# EAGLE design board (EAGLE 9.1.3)
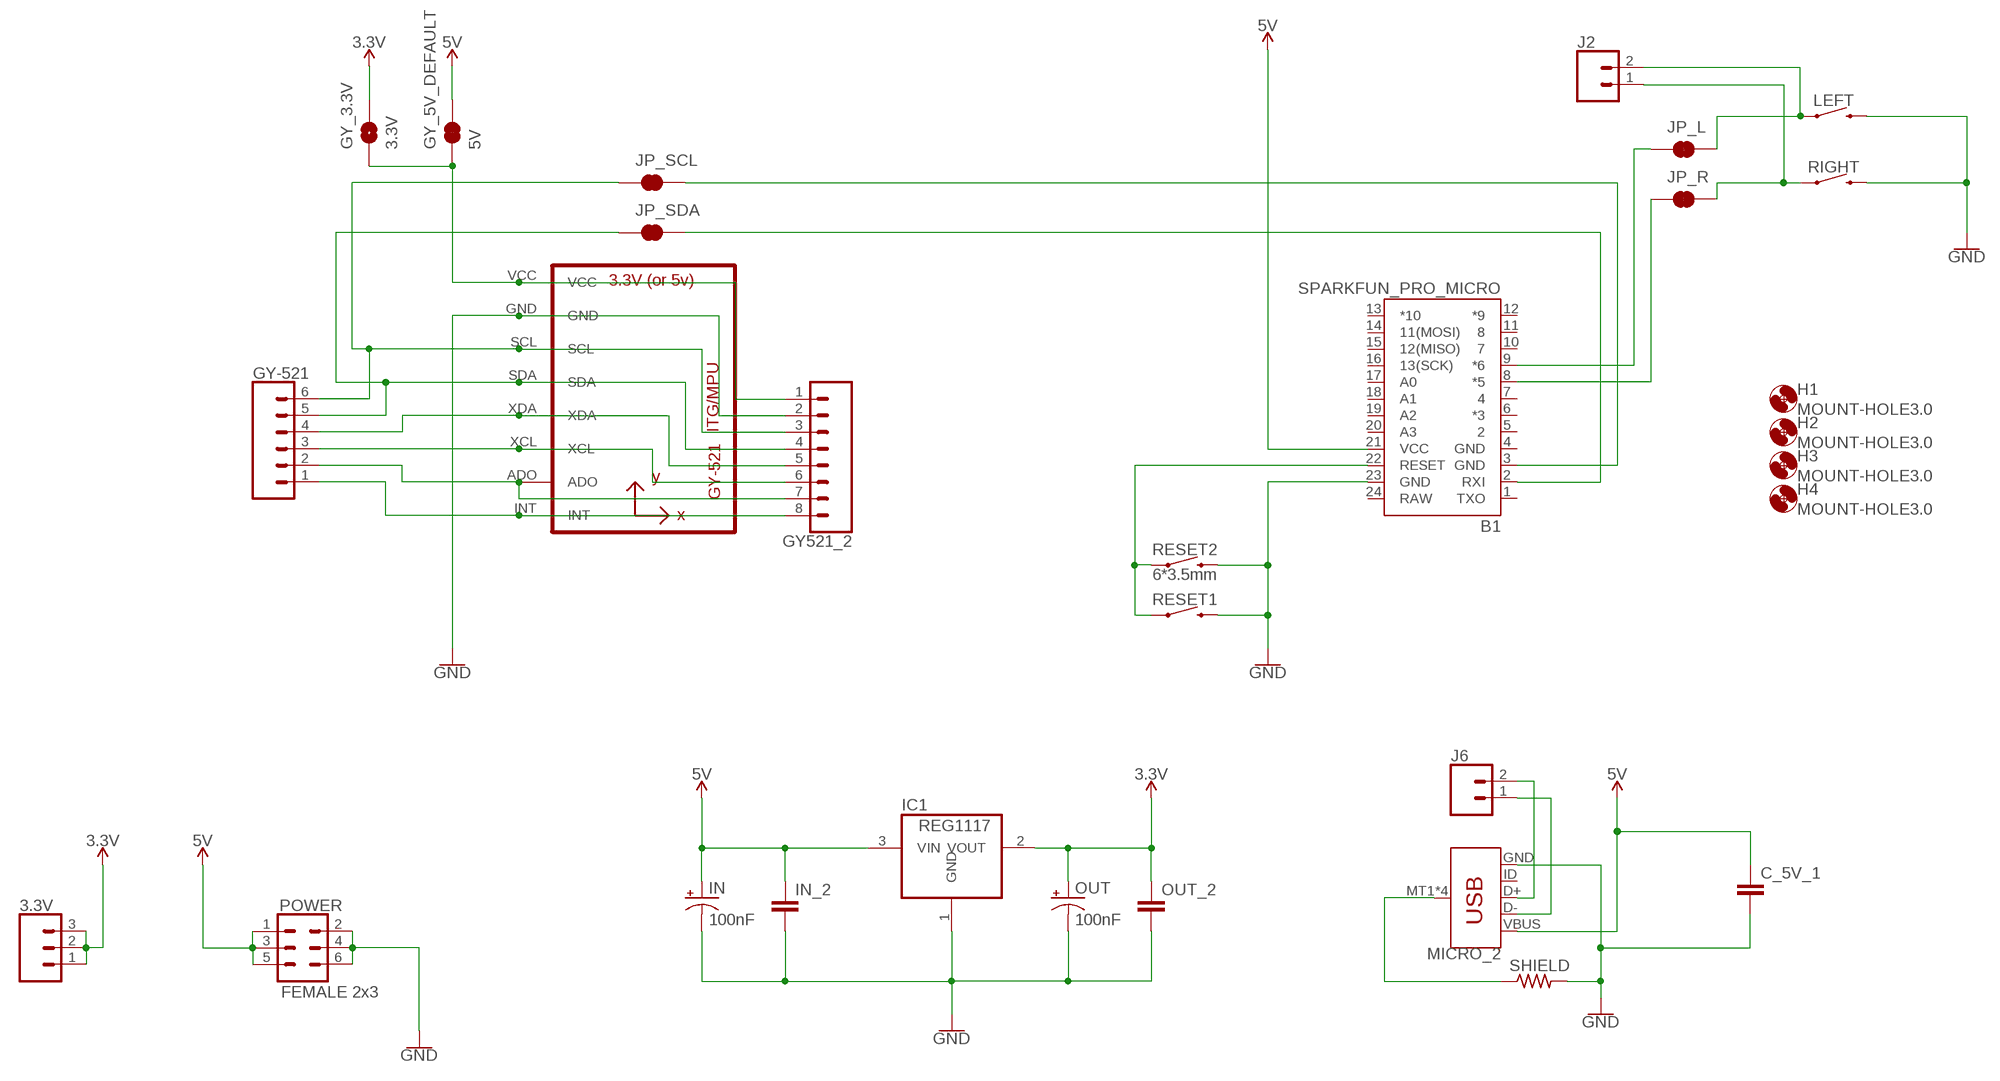
[diagram p0: schematic, sheet 1]

## Parts
3.3V  CONN_03  [1X03]
B1  SPARKFUN_PRO_MICRO  [SPARKFUN_PRO_MICRO]
C_5V_1  C-EUC0805  [C0805]
GY521_2  CONN_08"  [1X08]
GY-521  CONN_06LOCK  [1X06_LOCK]
GY_3.3V  3.3V  JUMPER-SMT_2_NO_NO-SILK  [SMT-JUMPER_2_NO_NO-SILK]
GY_5V_DEFAULT  5V  JUMPER-SMT_2_NC_TRACE_SILK  [SMT-JUMPER_2_NC_TRACE_SILK]
H1  MOUNT-HOLE3.0  [3,0]
H2  MOUNT-HOLE3.0  [3,0]
H3  MOUNT-HOLE3.0  [3,0]
H4  MOUNT-HOLE3.0  [3,0]
IC1  REG1117  [SOT223]
IN  100nF  CPOL-USE2.5-5  [E2,5-5]
IN_2  C-EUC0805  [C0805]
J2  CONN_02LOCK  [1X02_LOCK]
J6  CONN_02LOCK  [1X02_LOCK]
JP_L  JUMPER-SMT_2_NC_TRACE_SILK  [SMT-JUMPER_2_NC_TRACE_SILK]
JP_R  JUMPER-SMT_2_NC_TRACE_SILK  [SMT-JUMPER_2_NC_TRACE_SILK]
JP_SCL  JUMPER-SMT_2_NC_TRACE_SILK  [SMT-JUMPER_2_NC_TRACE_SILK]
JP_SDA  JUMPER-SMT_2_NC_TRACE_SILK  [SMT-JUMPER_2_NC_TRACE_SILK]
LEFT  MOMENTARY-SWITCH-SPST-PTH-6.0MM  [TACTILE_SWITCH_PTH_6.0MM]
MICRO_2  USB_MICRO-B_SMT  [USB-MICROB]
OUT  100nF  CPOL-USE2.5-5  [E2,5-5]
OUT_2  C-EUC0805  [C0805]
POWER  FEMALE 2x3  CONN_03X2FEMALE  [2X3]
RESET1  MOMENTARY-SWITCH-SPST-PTH-6.0MM  [TACTILE_SWITCH_PTH_6.0MM]
RESET2  6*3.5mm  MOMENTARY-SWITCH-SPST-SMD-6.0X3.5MM  [TACTILE_SWITCH_SMD_6.0X3.5MM]
RIGHT  MOMENTARY-SWITCH-SPST-PTH-6.0MM  [TACTILE_SWITCH_PTH_6.0MM]
SHIELD  R-US_R0805  [R0805]
U1  GY-521MPU6050  [GY-521]

## Nets
3.3V [power]: 3.3V.1 3.3V.2 3.3V.3 GY_3.3V.2 IC1.2(VOUT) OUT.+ OUT_2.1
5V [power]: B1.21(VCC) C_5V_1.1 GY_5V_DEFAULT.2 IC1.3(VIN) IN.+ IN_2.1 MICRO_2.VBUS POWER.1 POWER.3 POWER.5
D+: J6.2 MICRO_2.D+
D-: J6.1 MICRO_2.D-
GND [power]: B1.23(GND) C_5V_1.2 GY521_2.2 IC1.1(GND) IN.- IN_2.2 LEFT.3 MICRO_2.GND OUT.- OUT_2.2 POWER.2 POWER.4 POWER.6 RESET1.3 RESET2.2 RIGHT.3 SHIELD.2 U1.GND
N$1: J2.2 JP_L.2 LEFT.1
N$2: J2.1 JP_R.2 RIGHT.1
N$3: B1.8(*5) JP_R.1
N$4: B1.9(*6) JP_L.1
N$5 [power]: GY521_2.1 GY_3.3V.1 GY_5V_DEFAULT.1 U1.VCC
N$6: B1.22(RESET) RESET1.1 RESET2.1
N$7 [power]: MICRO_2.MT1(SHIELD) MICRO_2.MT2(SHIELD) MICRO_2.P$1(SHIELD) MICRO_2.P$2(SHIELD) SHIELD.1
N$8: B1.2(RXI) JP_SDA.2
N$9: B1.3(GND) JP_SCL.2
N$10: GY521_2.8 GY-521.1 U1.INT
N$11: GY521_2.7 GY-521.2 U1.ADO
N$12: GY521_2.6 GY-521.3 U1.XCL
N$13: GY521_2.5 GY-521.4 U1.XDA
SCL: GY521_2.3 GY-521.6 JP_SCL.1 U1.SCL
SDA: GY521_2.4 GY-521.5 JP_SDA.1 U1.SDA
Unconnected: B1.1(TXO) B1.5 B1.6(*3) B1.7 B1.10 B1.11 B1.12(*9) B1.13(*10) B1.14(11(MOSI)) B1.15(12(MISO)) B1.16(13(SCK)) B1.17(A0) B1.18(A1) B1.19(A2) B1.20(A3) MICRO_2.ID

## Power pins joined to a net without a drawn wire
GND: B1.4(GND)
RAW: B1.24(RAW)

## Library data of the parts
3.3V = SparkFun-Connectors:CONN_03: Multi connection point. Often used as Generic Header-pin footprint for 0.1 inch spaced/style header connections On any of the 0.1 inch spaced packages, you can populate with these: Break Away Headers - Straight <https://www.sparkfun.com/products/116> (PRT-00116) Break Away Male Headers - Right Angle <https://www.sparkfun.com/products/553> (PRT-00553) Female Headers <https://www.sparkfun.com/products/115> (PRT-00115) Break Away Headers - Machine Pin <https://www.sparkfun.com/products/117> (PRT-00117) Break Away Female Headers - Swiss Machine Pin <https://www.sparkfun.com/products/743> (PRT-00743) Stackable Header - 3 Pin (Female, 0.1") <https://www.sparkfun.com/products/13875> (PRT-13875) For SCREWTERMINALS and SPRING TERMINALS visit here: Screw Terimnals on SparkFun.com <https://www.sparkfun.com/search/results?term=Screw+Terminals> (5mm/3.5mm/2.54mm spacing) This device is also useful as a general connection point to wire up your design to another part of your project. Our various solder wires solder well into these plated through hole pads. Hook-Up Wire - Assortment (Stranded, 22 AWG) <https://www.sparkfun.com/products/11375> (PRT-11375) Hook-Up Wire - Assortment (Solid Core, 22 AWG) <https://www.sparkfun.com/products/11367> (PRT-11367) View the entire wire category on our website here <https://www.sparkfun.com/categories/141> Special notes: Molex polarized connector foot print use with SKU : PRT-08232 with associated crimp pins and housings.
B1 = SparkFun-Boards:SPARKFUN_PRO_MICRO: SparkFun Pro Micro Atmega32U4 compatible footprint. SparkFun Products: 3.3V/8MHz <https://www.sparkfun.com/products/12587> 5V/16MHz <https://www.sparkfun.com/products/12640>
C_5V_1 IN_2 OUT_2 = rcl:C-EU: CAPACITOR, European symbol; SPICEPREFIX: C
GY521_2 = SparkFun-Connectors:CONN_08: Multi connection point. Often used as Generic Header-pin footprint for 0.1 inch spaced/style header connections On any of the 0.1 inch spaced packages, you can populate with these: Break Away Headers - Straight <https://www.sparkfun.com/products/116> (PRT-00116) Break Away Male Headers - Right Angle <https://www.sparkfun.com/products/553> (PRT-00553) Female Headers <https://www.sparkfun.com/products/115> (PRT-00115) Break Away Headers - Machine Pin <https://www.sparkfun.com/products/117> (PRT-00117) Break Away Female Headers - Swiss Machine Pin <https://www.sparkfun.com/products/743> (PRT-00743) Arduino Stackable Header - 8 Pin <https://www.sparkfun.com/products/9279> (PRT-09279) For SCREWTERMINALS and SPRING TERMINALS visit here: Screw Terimnals on SparkFun.com <https://www.sparkfun.com/search/results?term=Screw+Terminals> (5mm/3.5mm/2.54mm spacing) This device is also useful as a general connection point to wire up your design to another part of your project. Our various solder wires solder well into these plated through hole pads. Hook-Up Wire - Assortment (Stranded, 22 AWG) <https://www.sparkfun.com/products/11375> (PRT-11375) Hook-Up Wire - Assortment (Solid Core, 22 AWG) <https://www.sparkfun.com/products/11367> (PRT-11367) View the entire wire category on our website here <https://www.sparkfun.com/categories/141> Special notes: Molex polarized connector foot print use with SKU : PRT-08231 with associated crimp pins and housings. 1MM SMD Version SKU: PRT-10208 NOTES ON THE VARIANTS LOCK and LOCK_LONGPADS... This footprint was designed to help hold the alignment of a through-hole component (i.e. 6-pin header) while soldering it into place. You may notice that each hole has been shifted either up or down by 0.005 of an inch from it's more standard position (which is a perfectly straight line). This slight alteration caused the pins (the squares in the middle) to touch the edges of the holes. Because they are alternating, it causes a "brace" to hold the component in place. 0.005 has proven to be the perfect amount of "off-center" position when using our standard breakaway headers. Although looks a little odd when you look at the bare footprint, once you have a header in there, the alteration is very hard to notice. Also,if you push a header all the way into place, it is covered up entirely on the bottom side.; PROD_ID: CONN-08438
GY-521 = SparkFun-Connectors:CONN_06: Multi connection point. Often used as Generic Header-pin footprint for 0.1 inch spaced/style header connections On any of the 0.1 inch spaced packages, you can populate with these: Break Away Headers - Straight <https://www.sparkfun.com/products/116> (PRT-00116) Break Away Male Headers - Right Angle <https://www.sparkfun.com/products/553> (PRT-00553) Female Headers <https://www.sparkfun.com/products/115> (PRT-00115) Break Away Headers - Machine Pin <https://www.sparkfun.com/products/117> (PRT-00117) Break Away Female Headers - Swiss Machine Pin <https://www.sparkfun.com/products/743> (PRT-00743) Arduino Stackable Header - 6 Pin <https://www.sparkfun.com/products/9280> (PRT-09280) For SCREWTERMINALS and SPRING TERMINALS visit here: Screw Terimnals on SparkFun.com <https://www.sparkfun.com/search/results?term=Screw+Terminals> (5mm/3.5mm/2.54mm spacing) This device is also useful as a general connection point to wire up your design to another part of your project. Our various solder wires solder well into these plated through hole pads. Hook-Up Wire - Assortment (Stranded, 22 AWG) <https://www.sparkfun.com/products/11375> (PRT-11375) Hook-Up Wire - Assortment (Solid Core, 22 AWG) <https://www.sparkfun.com/products/11367> (PRT-11367) View the entire wire category on our website here <https://www.sparkfun.com/categories/141>
GY_3.3V = SparkFun-Jumpers:JUMPER-SMT_2_NO: Normally open jumper This jumper has two pads in close proximity to each other. Apply solder to close the connection. Round pads are easier to solder for beginners, but are a lot larger. SparkFun Product that uses the round pads: SparkFun EL Sequencer <https://www.sparkfun.com/products/12781>
GY_5V_DEFAULT JP_L JP_R JP_SCL JP_SDA = SparkFun-Jumpers:JUMPER-SMT_2_NC_TRACE: Normally closed trace jumper This jumper has a trace between two pads so it's normally closed (NC). Use a razor knife to open the connection. For best results follow the IPC guidelines for cutting traces: Cutout at least 0.063 mm (0.005 in). Remove all loose material to clean up the cut area. Seal the cut with an approved epoxy. Reapply solder to reclose the connection.
H1-H4 = holes:MOUNT-HOLE: MOUNTING HOLE with drill center marker
IC1 = burr-brown:REG1117: 800mA and 1A Low Dropout (LDO) Positive Regulator 1.8V, 2.5V, 2.85V, 3.3V, 5V, and Adj; MPN: REG1117; OC_FARNELL: 1097566; OC_NEWARK: 14P6981
IN OUT = rcl:CPOL-US: POLARIZED CAPACITOR, American symbol; SPICEPREFIX: C
J2 J6 = SparkFun-Connectors:CONN_02: Multi connection point. Often used as Generic Header-pin footprint for 0.1 inch spaced/style header connections On any of the 0.1 inch spaced packages, you can populate with these: Break Away Headers - Straight <https://www.sparkfun.com/products/116> (PRT-00116) Break Away Male Headers - Right Angle <https://www.sparkfun.com/products/553> (PRT-00553) Female Headers <https://www.sparkfun.com/products/115> (PRT-00115) Break Away Headers - Machine Pin <https://www.sparkfun.com/products/117> (PRT-00117) Break Away Female Headers - Swiss Machine Pin <https://www.sparkfun.com/products/743> (PRT-00743) For SCREWTERMINALS and SPRING TERMINALS visit here: Screw Terimnals on SparkFun.com <https://www.sparkfun.com/search/results?term=Screw+Terminals> (5mm/3.5mm/2.54mm spacing) This device is also useful as a general connection point to wire up your design to another part of your project. Our various solder wires solder well into these plated through hole pads. Hook-Up Wire - Assortment (Stranded, 22 AWG) <https://www.sparkfun.com/products/11375> (PRT-11375) Hook-Up Wire - Assortment (Solid Core, 22 AWG) <https://www.sparkfun.com/products/11367> (PRT-11367) View the entire wire category on our website here <https://www.sparkfun.com/categories/141> Special notes: Molex polarized connector foot print use with: PRT-08233 with associated crimp pins and housings. 2.54_SCREWTERM for use with PRT-10571. 3.5mm Screw Terminal footprints for PRT-08084 5mm Screw Terminal footprints for use with PRT-08432
LEFT RESET1 RIGHT = SparkFun-Switches:MOMENTARY-SWITCH-SPST: Momentary Switch (Pushbutton) - SPST Normally-open (NO) SPST momentary switches (buttons, pushbuttons). Variants PTH-12MM - 12mm square, through-hole Momentary Pushbutton Switch - 12mm Square <https://www.sparkfun.com/products/9190> (COM-09190) PTH-6.0MM, PTH-6.0MM-KIT - 6.0mm square, through-hole Mini Pushbutton Switch <https://www.sparkfun.com/products/97> (COM-00097) KIT package intended for soldering kit's - only one side of pads' copper is exposed. PTH-RIGHT-ANGLE-KIT - Right-angle, through-hole Right Angle Tactile Button <https://www.sparkfun.com/products/10791> - Used on SparkFun BigTime Watch Kit <https://www.sparkfun.com/products/11734> SMD-12MM - 12mm square, surface-mount Tactile Button - SMD (12mm) <https://www.sparkfun.com/products/12993> (COM-12993) Used on SparkFun PicoBoard <https://www.sparkfun.com/products/11888> SMD-4.5MM - 4.5mm Square Trackball Switch Used on SparkFun Blackberry Trackballer Breakout <https://www.sparkfun.com/products/13169> SMD-4.6MMX2.8MM - 4.60mm x 2.80mm, surface mount Used on SparkFun SAMD21 Mini Breakout <https://www.sparkfun.com/products/13664> SMD-5.2MM, SMD-5.2-REDUNDANT - 5.2mm square, surface-mount Mini Pushbutton Switch - SMD <https://www.sparkfun.com/products/8720> (COM-08720) Used on Arduino Pro Mini <https://www.sparkfun.com/products/11114> REDUNDANT package connects both switch circuits together SMD-6.0X3.5MM - 6.0 x 3.5mm, surface mount Momentary Reset Switch SMD <https://www.sparkfun.com/products/8229> (COM-08229) SMD-6.2MM-TALL - 6.2mm square, surface mount Tactile Button - SMD (6mm) <https://www.sparkfun.com/products/12992> Used on SparkFun Digital Sandbox <https://www.sparkfun.com/products/12651> SMD-RIGHT-ANGLE - Right-angle, surface mount Used on SparkFun Block for Intel® Edison - Arduino <https://www.sparkfun.com/products/13036>; PROD_ID: SWCH-08441; SF_SKU: COM-00097
MICRO_2 = SparkFun-Connectors:USB_MICRO-B: USB Type Micro-B Connector Male/female and PTH/SMT variants SparkFun Products: SparkFun microB USB Breakout <https://www.sparkfun.com/products/12035> SparkFun USB microB Plug Breakout <https://www.sparkfun.com/products/10031> SparkFun ESP8266 Thing <https://www.sparkfun.com/products/13231>; PROD_ID: CONN-09505; SF_ID: PRT-08533
POWER = SparkFun-Connectors:CONN_03X2: Multi connection point. Often used as Generic Header-pin footprint for 0.1 inch spaced/style header connections You can populate with any combo of single row headers, but if you'd like an exact match, check these: Header - 2x3 (Male, 0.1") <https://www.sparkfun.com/products/12807> (PRT-12807) Header - 2x3 (Female, 0.1") <https://www.sparkfun.com/products/13010> (PRT-13010) 2x3 Pin Shrouded Header <https://www.sparkfun.com/products/10877> (PRT-10877) On any of the 0.1 inch spaced packages, you can populate with these: Break Away Headers - Straight <https://www.sparkfun.com/products/116> (PRT-00116) Break Away Male Headers - Right Angle <https://www.sparkfun.com/products/553> (PRT-00553) Female Headers <https://www.sparkfun.com/products/115> (PRT-00115) Break Away Headers - Machine Pin <https://www.sparkfun.com/products/117> (PRT-00117) Break Away Female Headers - Swiss Machine Pin <https://www.sparkfun.com/products/743> (PRT-00743) Special note: the shrouded connector mates well with our 3x2 ribbon cables: Ribbon Crimp Connector - 6-pin (2x3, Female) <https://www.sparkfun.com/products/10651> (PRT-10651) Ribbon Cable - 6 wire (15ft) <https://www.sparkfun.com/products/10646> (PRT-10646); PROD_ID: CONN-11566
RESET2 = SparkFun-Switches:MOMENTARY-SWITCH-SPST: Momentary Switch (Pushbutton) - SPST Normally-open (NO) SPST momentary switches (buttons, pushbuttons). Variants PTH-12MM - 12mm square, through-hole Momentary Pushbutton Switch - 12mm Square <https://www.sparkfun.com/products/9190> (COM-09190) PTH-6.0MM, PTH-6.0MM-KIT - 6.0mm square, through-hole Mini Pushbutton Switch <https://www.sparkfun.com/products/97> (COM-00097) KIT package intended for soldering kit's - only one side of pads' copper is exposed. PTH-RIGHT-ANGLE-KIT - Right-angle, through-hole Right Angle Tactile Button <https://www.sparkfun.com/products/10791> - Used on SparkFun BigTime Watch Kit <https://www.sparkfun.com/products/11734> SMD-12MM - 12mm square, surface-mount Tactile Button - SMD (12mm) <https://www.sparkfun.com/products/12993> (COM-12993) Used on SparkFun PicoBoard <https://www.sparkfun.com/products/11888> SMD-4.5MM - 4.5mm Square Trackball Switch Used on SparkFun Blackberry Trackballer Breakout <https://www.sparkfun.com/products/13169> SMD-4.6MMX2.8MM - 4.60mm x 2.80mm, surface mount Used on SparkFun SAMD21 Mini Breakout <https://www.sparkfun.com/products/13664> SMD-5.2MM, SMD-5.2-REDUNDANT - 5.2mm square, surface-mount Mini Pushbutton Switch - SMD <https://www.sparkfun.com/products/8720> (COM-08720) Used on Arduino Pro Mini <https://www.sparkfun.com/products/11114> REDUNDANT package connects both switch circuits together SMD-6.0X3.5MM - 6.0 x 3.5mm, surface mount Momentary Reset Switch SMD <https://www.sparkfun.com/products/8229> (COM-08229) SMD-6.2MM-TALL - 6.2mm square, surface mount Tactile Button - SMD (6mm) <https://www.sparkfun.com/products/12992> Used on SparkFun Digital Sandbox <https://www.sparkfun.com/products/12651> SMD-RIGHT-ANGLE - Right-angle, surface mount Used on SparkFun Block for Intel® Edison - Arduino <https://www.sparkfun.com/products/13036>; PROD_ID: SWCH-00815; SF_SKU: COM-08229
SHIELD = rcl:R-US_: RESISTOR, American symbol; SPICEPREFIX: R
U1 = gy-521:GY-521

## Net classes
0 default: width 0.203 mm
1 power: width 0.635 mm

## Board
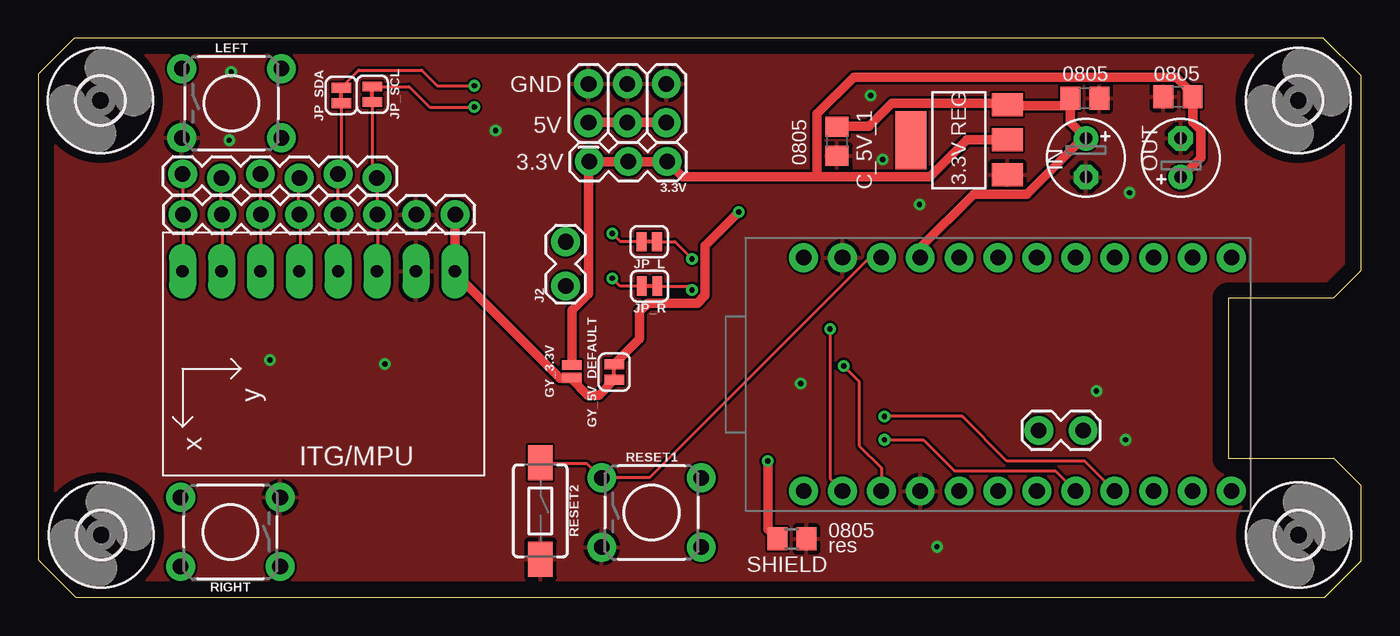
[diagram p1: board, top side]
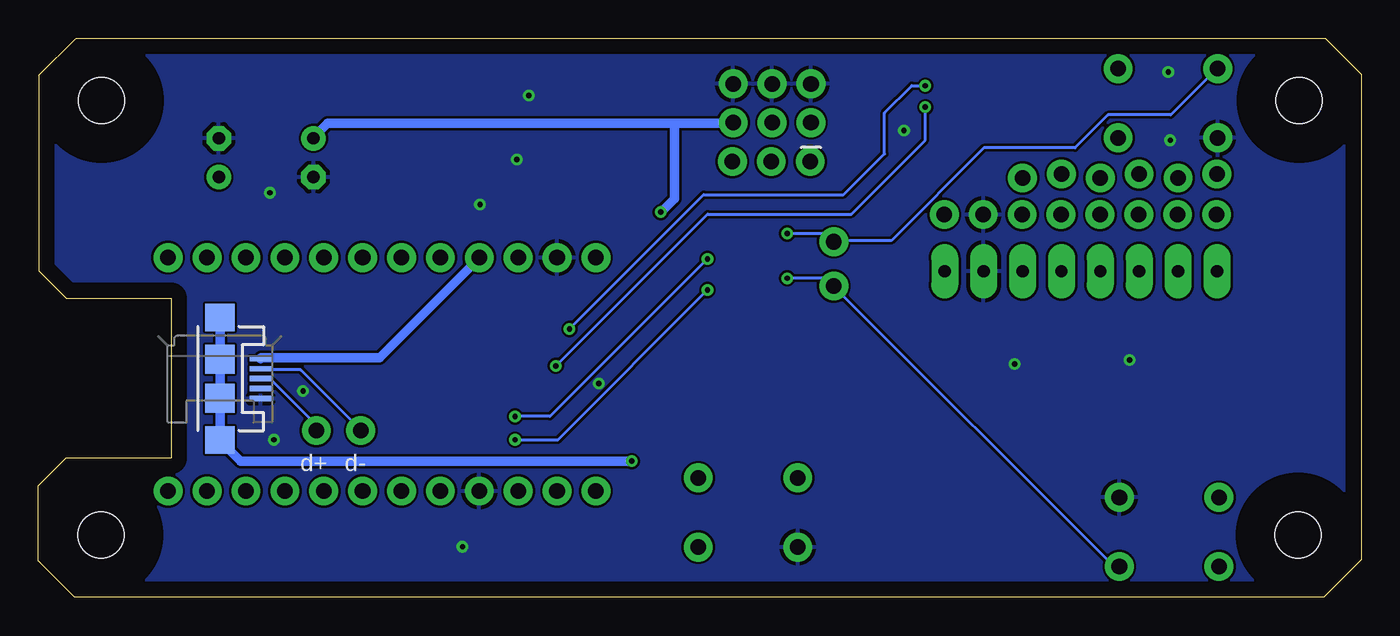
[diagram p2: board, bottom side, seen from below]

Size 86.41 x 36.5 mm. Coordinates in mm from the lower left corner, seen from the top.
Outline: 2.36,36.5 0,34.14 0,2.44 2.44,0 84.02,0 86.41,2.39 86.41,7.29 84.61,9.09 77.72,9.09 77.72,19.53 84.58,19.53 86.39,21.34 86.39,34.09 83.95,36.5 2.36,36.5
Copper layers (1*16): Top 0.035mm / dielectric 1.5mm / Bottom 0.035mm
Design rules "default": minimum track width 6mil, minimum drill 0.35mm, track to track 6mil, track to pad 6mil, pad to pad 6mil, via to via 6mil, smd to smd 6mil, copper to edge 40mil, drill to drill 6mil, minimum pad ring 10mil, minimum via ring 8mil, stop-mask expansion 4mil, vias tented up to drill 0mil, thermal gap 10mil

### Footprints (pad centres in the part's own frame; a part is rotated, then mirrored left to right if it is on the bottom)
1X03 = drill 1.016 pad 1.88: 1 0,0; 2 2.54,0; 3 5.08,0
SPARKFUN_PRO_MICRO = drill 1.016 pad 1.88: 1 -7.62,12.7; 2 -7.62,10.16; 3 -7.62,7.62; 4 -7.62,5.08; 5 -7.62,2.54; 6 -7.62,0; 7 -7.62,-2.54; 8 -7.62,-5.08; 9 -7.62,-7.62; 10 -7.62,-10.16; 11 -7.62,-12.7; 12 -7.62,-15.24; 13 7.62,-15.24; 14 7.62,-12.7; 15 7.62,-10.16; 16 7.62,-7.62; 17 7.62,-5.08; 18 7.62,-2.54; 19 7.62,0; 20 7.62,2.54; 21 7.62,5.08; 22 7.62,7.62; 23 7.62,10.16; 24 7.62,12.7
C0805 = smd 1.3 x 1.5: 1 -0.95,0; 2 0.95,0
1X08 = drill 1.016 pad 1.88: 1 0,0; 2 2.54,0; 3 5.08,0; 4 7.62,0; 5 10.16,0; 6 12.7,0; 7 15.24,0; 8 17.78,0
1X06_LOCK = drill 1.016 pad 1.88: 1 0,0; 2 2.54,-0.254; 3 5.08,0; 4 7.62,-0.254; 5 10.16,0; 6 12.7,-0.254
SMT-JUMPER_2_NO_NO-SILK = smd 0.635 x 1.27: 1 -0.406,0; 2 0.406,0
SMT-JUMPER_2_NC_TRACE_SILK = smd 0.635 x 1.27: 1 -0.508,0; 2 0.508,0
3,0 = hole 3: 0,0
SOT223 = smd 1.499 x 2.007: 1 -2.261,-3.15; 2 0.025,-3.15; 3 2.311,-3.15 | smd 3.81 x 2.007: 4 0,3.15
E2,5-5 = drill 0.813 pad 1.6: + -1.27,0 | drill 0.813 pad 1.6 octagon: - 1.27,0
1X02_LOCK = drill 1.016 pad 1.88: 1 -0.178,0; 2 2.718,0
TACTILE_SWITCH_PTH_6.0MM = drill 1.016 pad 1.88: 1 -3.251,2.261; 2 3.251,2.261; 3 -3.251,-2.261; 4 3.251,-2.261
USB-MICROB = smd 1.4 x 0.35: D+ -2.65,0; D- -2.65,-0.65; GND -2.65,1.3; ID -2.65,0.65; VBUS -2.65,-1.3 | smd 1.9 x 1.8: MT1 0,-4; MT2 0,4 | smd 1.9 x 1.9: P$1 0,-1.27; P$2 0,1.27
2X3 = drill 1.016 pad 1.88: 1 0,0; 2 0,2.54; 3 2.54,0; 4 2.54,2.54; 5 5.08,0; 6 5.08,2.54
TACTILE_SWITCH_SMD_6.0X3.5MM = smd 2.3 x 1.6: 1 -3.15,0; 2 3.15,0
R0805 = smd 1.3 x 1.5: 1 -0.95,0; 2 0.95,0
GY-521 = drill 0.8 pad 1.778 long: ADO -8.89,-6.35; GND -8.89,6.35; INT -8.89,-8.89; SCL -8.89,3.81; SDA -8.89,1.27; VCC -8.89,8.89; XCL -8.89,-3.81; XDA -8.89,-1.27

### Placement (x,y rotation side)
3.3V  41.07,28.45 180 top
B1  62.69,14.55 90 top
C_5V_1  52.17,29.77 270 top
GY521_2  27.23,24.99 180 top
GY-521  9.42,27.64 0 top
GY_3.3V  34.85,14.76 90 top
GY_5V_DEFAULT  37.62,14.71 90 top
H1  4.06,32.44 0 top
H2  82.3,32.44 0 top
H3  4.11,4.06 0 top
H4  82.32,4.06 0 top
IC1  60.15,29.84 90 top
IN  68.43,28.7 270 top
IN_2  68.35,32.59 0 top
J2  34.44,20.5 90 top
J6  65.53,10.9 0 top
JP_L  39.9,23.22 180 top
JP_R  39.93,20.32 180 top
JP_SCL  21.82,32.84 90 top
JP_SDA  19.79,32.77 90 top
LEFT  12.62,32.26 0 top
MICRO_2  74.55,14.27 180 bottom
OUT  74.63,28.7 90 top
OUT_2  74.45,32.69 180 top
POWER  35.94,30.99 0 top
RESET1  40.06,5.54 0 top
RESET2  32.79,5.64 270 top
RIGHT  12.55,4.27 180 top
SHIELD  49.23,3.81 0 top
U1  18.31,12.4 270 top

### Tracks (layer width: path | path; a pad name or v marks a point on that pad's centre or on a via)
3.3V
  Top 0.635: GY_3.3V.2 34.87,15.2 34.87,18.76 35.94,19.82 35.94,28.45 3.3V.3 3.3V.2 3.3V.1 41.1,28.45 42.08,27.47 50.88,27.47 | OUT.+ 74.7,27.47 75.95,28.71 75.95,30.49 75.41,31.03 75.41,32.63 OUT_2.1 75.32,32.98 74.35,33.96 53.28,33.96 50.88,31.56 50.88,27.47 | IC1.2 60.66,29.87 58.26,27.47 50.88,27.47
5V  (via drill 0.35)
  Top 0.635: POWER.1 35.94,31.03 38.43,31.03 POWER.3 38.79,31.03 41.01,31.03 POWER.5 | C_5V_1.1 52.21,30.76 54.25,30.76 55.77,32.27 63.14,32.27 63.23,32.18 IC1.3 63.59,32.09 67.15,32.09 IN_2.1 67.41,32.54 67.41,31.03 68.39,30.05 IN.+ 68.12,29.87 64.57,26.31 61.1,26.31 57.63,22.85 57.63,22.23 B1.21 | v45.75,25.15 43.55,22.95 43.55,19.71 43.05,19.21 39.81,19.21 39.27,18.67 39.27,16.87 GY_5V_DEFAULT.2
  Bottom 0.635: MICRO_2.VBUS 71.86,15.65 64.12,15.65 57.63,22.14 B1.21 | 44.86,30.94 45.49,30.94 67.5,30.94 68.39,30.05 IN.+ | 44.86,30.94 41.1,30.94 POWER.5 | 44.86,30.94 44.86,26.04 v45.75,25.15
D+
  Bottom 0.203: MICRO_2.D+ 71.86,14.22 71.23,14.22 68.3,11.29 68.3,10.94 J6.2
D-
  Bottom 0.203: MICRO_2.D- 71.86,14.85 69.28,14.85 65.37,10.94 J6.1
GND  (via drill 0.35)
  other vias: 55.14,28.57 69.11,13.46 29.87,30.48 54.38,32.77 71.27,26.42 57.56,25.65 49.81,13.97 71.02,10.29 12.6,34.29 12.47,29.84 15.14,15.49 22.63,15.24 58.7,3.3
  pour Top: -1.02,36.8 -1.02,-0.91 87.63,-0.91 87.63,36.8
  pour Bottom: -4.29,38.33 -4.29,-3.05 89.84,-3.05 89.84,38.33
N$1  (via drill 0.35)
  Top 0.203: JP_L.2 38.02,23.22 v37.49,23.75
  Bottom 0.203: LEFT.1 9.45,34.49 12.45,31.5 16.54,31.5 18.69,29.34 24.65,29.34 30.7,23.29 34.43,23.29 J2.2 34.98,23.75 v37.49,23.75
N$2  (via drill 0.35)
  Top 0.203: JP_R.2 38,20.32 v37.49,20.83
  Bottom 0.203: RIGHT.1 15.85,2.04 16.21,2.04 34.43,20.27 J2.1 34.95,20.83 v37.49,20.83
N$3  (via drill 0.35)
  Top 0.203: B1.8 66.45,8.26 59.84,8.26 57.81,10.29 v55.27,10.29 | JP_R.1 42.44,20.32 v42.7,20.07
  Bottom 0.203: 55.02,10.29 v55.27,10.29 52.48,10.29 v42.7,20.07
N$4  (via drill 0.35)
  Top 0.203: B1.9 68.35,8.89 63.27,8.89 60.35,11.81 v55.27,11.81 | JP_L.1 41.58,23.22 v42.7,22.1
  Bottom 0.203: v42.7,22.1 52.98,11.81 v55.27,11.81
N$5
  Top 0.635: 34.79,14.31 34.07,14.31 27.14,21.25 U1.VCC 27.23,21.6 GY521_2.1 | 34.79,14.31 GY_3.3V.1 | GY_5V_DEFAULT.1 36.63,13.21 35.89,13.21 34.79,14.31
N$6
  Top 0.203: RESET2.1 32.83,8.71 35.85,8.71 36.74,7.82 RESET1.1 36.83,7.82 39.94,7.82 54.25,22.14 55.05,22.14 B1.22
N$7  (via drill 0.35)
  Top 0.635: SHIELD.1 47.65,4.43 v47.65,8.89
  Bottom 0.635: MICRO_2.MT1 74.52,18.22 74.52,15.82 MICRO_2.P$1 74.52,15.47 74.52,13.25 MICRO_2.P$2 74.52,12.98 74.52,10.58 MICRO_2.MT2 74.52,10.22 73.19,8.89 v47.65,8.89
N$8  (via drill 0.35)
  Top 0.203: JP_SDA.2 20.93,34.42 25.04,34.42 26.06,33.4 v28.47,33.4 | B1.2 51.71,7.75 v51.71,17.53
  Bottom 0.203: v28.47,33.4 29.36,33.4 31.14,31.62 31.14,28.96 33.81,26.29 42.95,26.29 v51.71,17.53
N$9  (via drill 0.35)
  Top 0.203: JP_SCL.2 24.21,33.35 25.55,32 v28.47,32 | v52.6,15.11 53.62,14.1 53.62,9.91 55.07,8.46 B1.3
  Bottom 0.203: v28.47,32 28.47,29.84 33.3,25.02 42.7,25.02 v52.6,15.11
N$10
  Top 0.203: U1.INT 9.45,21.34 GY521_2.8 9.45,27.56 GY-521.1
N$11
  Top 0.203: U1.ADO 12.03,21.34 12.03,24.98 GY521_2.7 11.94,25.07 11.94,27.38 GY-521.2
N$12
  Top 0.203: U1.XCL 14.52,21.34 GY521_2.6 14.52,25.07 14.52,27.56 GY-521.3
N$13
  Top 0.203: U1.XDA 17.09,21.34 17.09,24.98 GY521_2.5 17.01,25.07 17.01,27.38 GY-521.4
SCL
  Top 0.203: U1.SCL 22.16,21.34 22.16,24.98 GY521_2.3 22.16,25.07 22.16,27.38 | 22.16,27.38 GY-521.6 | JP_SCL.1 21.82,27.72 22.16,27.38
SDA
  Top 0.203: U1.SDA 19.58,24.98 GY521_2.4 19.58,25.07 GY-521.5 19.79,27.84 JP_SDA.1

### Text on the board
tPlace: 0805 | 0805 | GND | 5V | 3.3V | 0805 | 3.3V REG | 0805 / res
bPlace: d- | d+